# EAGLE design 32_ch_sample_and_hold (EAGLE 7.2.0)
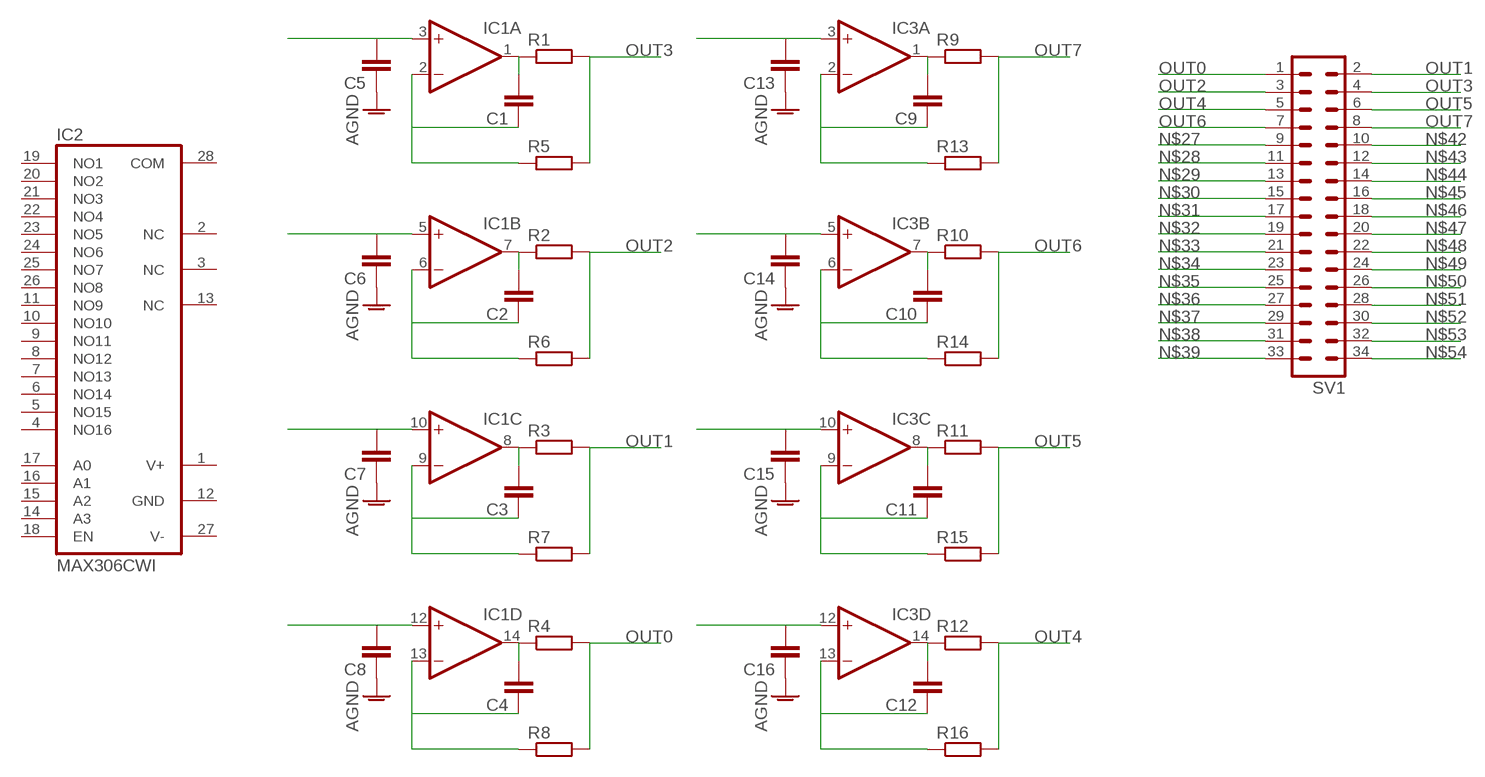
[diagram p0: schematic, sheet 1]

## Parts
C1  C-EUC0603  [C0603]
C2  C-EUC0603  [C0603]
C3  C-EUC0603  [C0603]
C4  C-EUC0603  [C0603]
C5  C-EUC1206  [C1206]
C6  C-EUC1206  [C1206]
C7  C-EUC1206  [C1206]
C8  C-EUC1206  [C1206]
C9  C-EUC0603  [C0603]
C10  C-EUC0603  [C0603]
C11  C-EUC0603  [C0603]
C12  C-EUC0603  [C0603]
C13  C-EUC1206  [C1206]
C14  C-EUC1206  [C1206]
C15  C-EUC1206  [C1206]
C16  C-EUC1206  [C1206]
IC1  TL074D  [SO14]
IC2  MAX306CWI  [SO28L]
IC3  TL074D  [SO14]
R1  R-EU_R0603  [R0603]
R2  R-EU_R0603  [R0603]
R3  R-EU_R0603  [R0603]
R4  R-EU_R0603  [R0603]
R5  R-EU_R0603  [R0603]
R6  R-EU_R0603  [R0603]
R7  R-EU_R0603  [R0603]
R8  R-EU_R0603  [R0603]
R9  R-EU_R0603  [R0603]
R10  R-EU_R0603  [R0603]
R11  R-EU_R0603  [R0603]
R12  R-EU_R0603  [R0603]
R13  R-EU_R0603  [R0603]
R14  R-EU_R0603  [R0603]
R15  R-EU_R0603  [R0603]
R16  R-EU_R0603  [R0603]
SV1  MA17-2  [MA17-2]

## Nets
AGND: C5.1 C6.1 C7.1 C8.1 C13.1 C14.1 C15.1 C16.1
N$1: C1.2 IC1.1(A:OUT) R1.1
N$2: C2.2 IC1.7(B:OUT) R2.1
N$3: C3.2 IC1.8(C:OUT) R3.1
N$4: C4.2 IC1.14(D:OUT) R4.1
N$5: C1.1 IC1.2(A:-IN) R5.1
N$6: C2.1 IC1.6(B:-IN) R6.1
N$7: C3.1 IC1.9(C:-IN) R7.1
N$8: C4.1 IC1.13(D:-IN) R8.1
N$9: C9.2 IC3.1(A:OUT) R9.1
N$10: C10.2 IC3.7(B:OUT) R10.1
N$11: C11.2 IC3.8(C:OUT) R11.1
N$12: C12.2 IC3.14(D:OUT) R12.1
N$13: C8.2 IC1.12(D:+IN)
N$14: C7.2 IC1.10(C:+IN)
N$15: C6.2 IC1.5(B:+IN)
N$16: C5.2 IC1.3(A:+IN)
N$17: C9.1 IC3.2(A:-IN) R13.1
N$18: C10.1 IC3.6(B:-IN) R14.1
N$19: C11.1 IC3.9(C:-IN) R15.1
N$20: C12.1 IC3.13(D:-IN) R16.1
N$21: C16.2 IC3.12(D:+IN)
N$22: C15.2 IC3.10(C:+IN)
N$23: C14.2 IC3.5(B:+IN)
N$24: C13.2 IC3.3(A:+IN)
N$27: SV1.9
N$28: SV1.11
N$29: SV1.13
N$30: SV1.15
N$31: SV1.17
N$32: SV1.19
N$33: SV1.21
N$34: SV1.23
N$35: SV1.25
N$36: SV1.27
N$37: SV1.29
N$38: SV1.31
N$39: SV1.33
N$42: SV1.10
N$43: SV1.12
N$44: SV1.14
N$45: SV1.16
N$46: SV1.18
N$47: SV1.20
N$48: SV1.22
N$49: SV1.24
N$50: SV1.26
N$51: SV1.28
N$52: SV1.30
N$53: SV1.32
N$54: SV1.34
OUT0: R4.2 R8.2 SV1.1
OUT1: R3.2 R7.2 SV1.2
OUT2: R2.2 R6.2 SV1.3
OUT3: R1.2 R5.2 SV1.4
OUT4: R12.2 R16.2 SV1.5
OUT5: R11.2 R15.2 SV1.6
OUT6: R10.2 R14.2 SV1.7
OUT7: R9.2 R13.2 SV1.8
Unconnected: IC2.2(NC) IC2.3(NC) IC2.4(NO16) IC2.5(NO15) IC2.6(NO14) IC2.7(NO13) IC2.8(NO12) IC2.9(NO11) IC2.10(NO10) IC2.11(NO9) IC2.13(NC) IC2.14(A3) IC2.15(A2) IC2.16(A1) IC2.17(A0) IC2.18(EN) IC2.19(NO1) IC2.20(NO2) IC2.21(NO3) IC2.22(NO4) IC2.23(NO5) IC2.24(NO6) IC2.25(NO7) IC2.26(NO8) IC2.28(COM)

## Power pins joined to a net without a drawn wire
GND: IC2.12(GND)
V+: IC1.4(P:V+) IC2.1(V+) IC3.4(P:V+)
V-: IC1.11(P:V-) IC2.27(V-) IC3.11(P:V-)

## Library data of the parts
C1-C16 = resistor:C-EU: CAPACITOR, European symbol
IC1 IC3 = linear:TL074: OP AMP
IC2 = maxim:MAX306CWI: MULTIPLEXER; MF: MAXIM; MPN: MAX306CWI; OC_FARNELL: unknown; OC_NEWARK: 90C2555
R1-R16 = resistor:R-EU_: RESISTOR, European symbol
SV1 = con-lstb:MA17-2: PIN HEADER; OC_FARNELL: unknown; OC_NEWARK: unknown

## Board
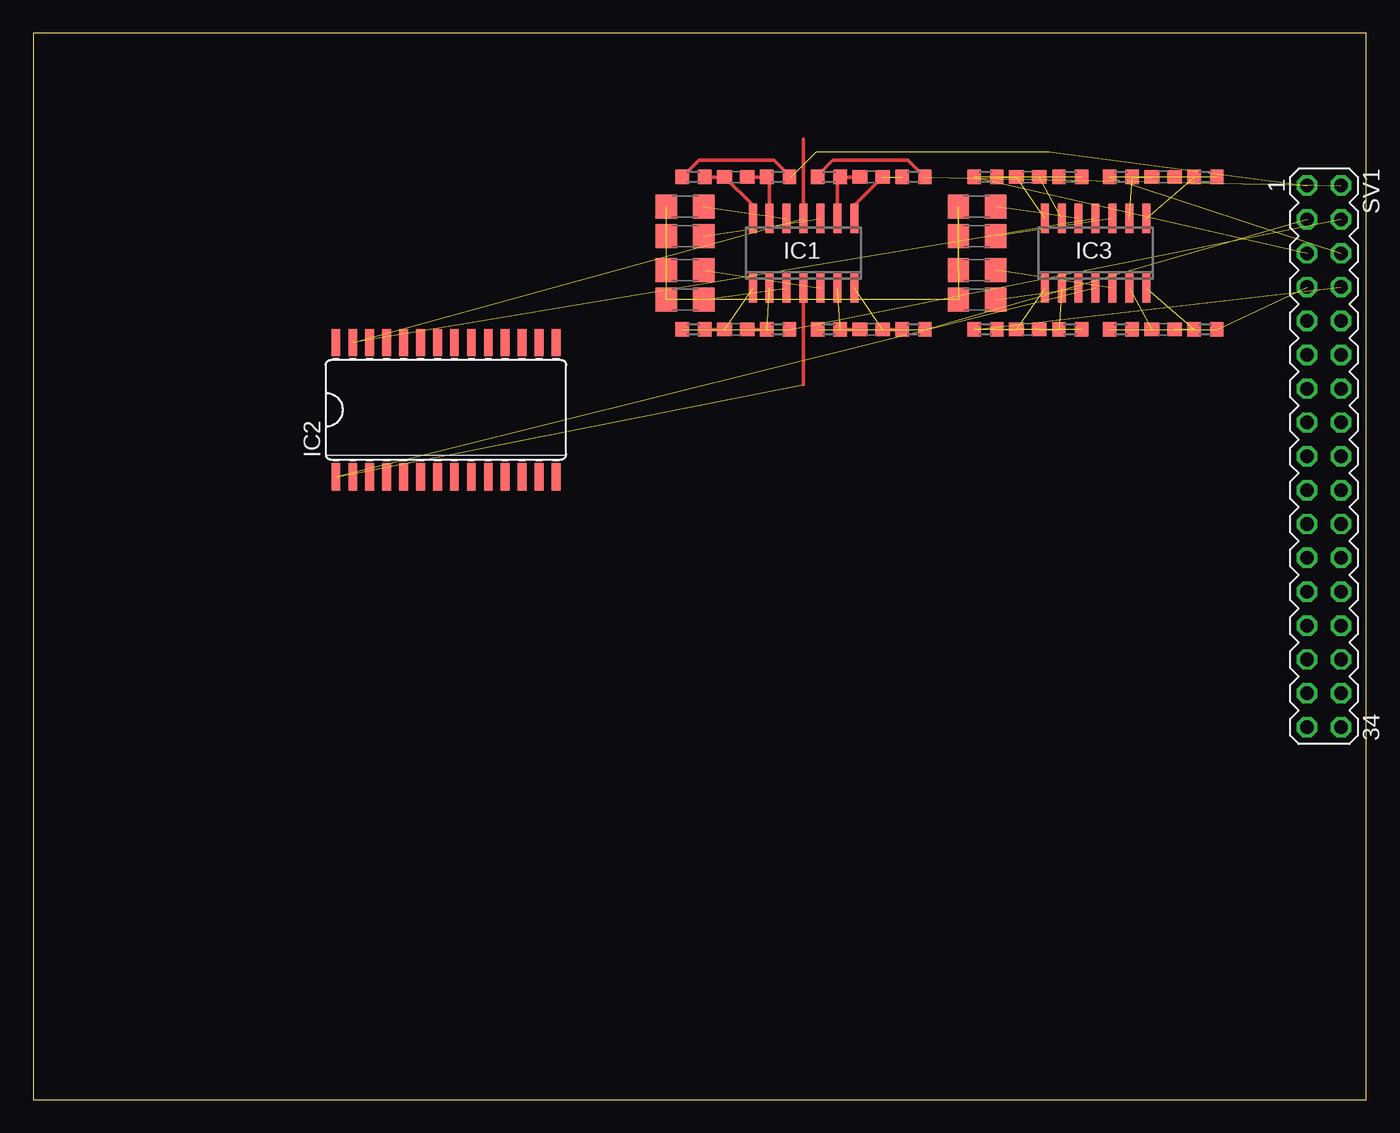
[diagram p1: board, top side]

Size 100 x 80 mm. Coordinates in mm from the lower left corner, seen from the top.
Outline: 0,0 100,0 100,80 0,80 0,0
Copper layers (1*16): Top 0.0356mm / dielectric 1.5011mm / Bottom 0.0356mm
Design rules "LaenPCBOrder": minimum track width 6mil, minimum drill 13mil, track to track 6mil, track to pad 6mil, pad to pad 6mil, via to via 6mil, smd to smd 6mil, copper to edge 15mil, drill to drill 6mil, minimum pad ring 7mil, minimum via ring 7mil, stop-mask expansion 3mil, vias tented up to drill 0mil, thermal gap 10mil

### Footprints (pad centres in the part's own frame; a part is rotated, then mirrored left to right if it is on the bottom)
C0603 = smd 1.1 x 1: 1 -0.85,0; 2 0.85,0
C1206 = smd 1.6 x 1.8: 1 -1.4,0; 2 1.4,0
SO14 = smd 0.6 x 2.2: 1 -3.81,-2.6; 2 -2.54,-2.6; 3 -1.27,-2.6; 4 0,-2.6; 5 1.27,-2.6; 6 2.54,-2.6; 7 3.81,-2.6; 8 3.81,2.6; 9 2.54,2.6; 10 1.27,2.6; 11 0,2.6; 12 -1.27,2.6; 13 -2.54,2.6; 14 -3.81,2.6
SO28L = smd 0.66 x 2.032: 1 -8.255,-5.029; 2 -6.985,-5.029; 3 -5.715,-5.029; 4 -4.445,-5.029; 5 -3.175,-5.029; 6 -1.905,-5.029; 7 -0.635,-5.029; 8 0.635,-5.029; 9 1.905,-5.029; 10 3.175,-5.029; 11 4.445,-5.029; 12 5.715,-5.029; 13 6.985,-5.029; 14 8.255,-5.029; 15 8.255,5.029; 16 6.985,5.029; 17 5.715,5.029; 18 4.445,5.029; 19 3.175,5.029; 20 1.905,5.029; 21 0.635,5.029; 22 -0.635,5.029; 23 -1.905,5.029; 24 -3.175,5.029; 25 -4.445,5.029; 26 -5.715,5.029; 27 -6.985,5.029; 28 -8.255,5.029
R0603 = smd 1 x 1.1: 1 -0.85,0; 2 0.85,0
MA17-2 = drill 1.016 octagon: 1 -20.32,-1.27; 2 -20.32,1.27; 3 -17.78,-1.27; 4 -17.78,1.27; 5 -15.24,-1.27; 6 -15.24,1.27; 7 -12.7,-1.27; 8 -12.7,1.27; 9 -10.16,-1.27; 10 -10.16,1.27; 11 -7.62,-1.27; 12 -7.62,1.27; 13 -5.08,-1.27; 14 -5.08,1.27; 15 -2.54,-1.27; 16 -2.54,1.27; 17 0,-1.27; 18 0,1.27; 19 2.54,-1.27; 20 2.54,1.27; 21 5.08,-1.27; 22 5.08,1.27; 23 7.62,-1.27; 24 7.62,1.27; 25 10.16,-1.27; 26 10.16,1.27; 27 12.7,-1.27; 28 12.7,1.27; 29 15.24,-1.27; 30 15.24,1.27; 31 17.78,-1.27; 32 17.78,1.27; 33 20.32,-1.27; 34 20.32,1.27

### Placement (x,y rotation side)
C1  52.7,57.78 180 top
C2  62.87,57.78 0 top
C3  62.87,69.22 0 top
C4  52.7,69.22 180 top
C5  48.9,60.01 0 top
C6  48.9,62.23 0 top
C7  48.9,64.77 0 top
C8  48.9,66.99 0 top
C9  74.61,57.78 180 top
C10  84.77,57.78 0 top
C11  84.77,69.22 0 top
C12  74.61,69.22 180 top
C13  70.8,60.01 0 top
C14  70.8,62.23 0 top
C15  70.8,64.77 0 top
C16  70.8,66.99 0 top
IC1  57.78,63.5 0 top
IC2  30.96,51.75 0 top
IC3  79.69,63.5 0 top
R1  49.53,57.78 180 top
R2  66.04,57.78 0 top
R3  66.04,69.22 0 top
R4  49.53,69.22 180 top
R5  55.88,57.78 0 top
R6  59.69,57.78 180 top
R7  59.69,69.22 180 top
R8  55.88,69.22 0 top
R9  71.44,57.78 180 top
R10  87.95,57.78 0 top
R11  87.95,69.22 0 top
R12  71.44,69.22 180 top
R13  77.79,57.78 0 top
R14  81.6,57.78 180 top
R15  81.6,69.22 180 top
R16  77.79,69.22 180 top
SV1  96.84,48.26 270 top

### Tracks (layer width: path | path; a pad name or v marks a point on that pad's centre or on a via)
AGND  (7 unrouted)
N$1  (1 unrouted)
  Top 0.254: R1.1 C1.2
N$2  (1 unrouted)
  Top 0.254: C2.2 R2.1
N$3  (1 unrouted)
  Top 0.254: IC1.8 61.59,67.09 C3.2
N$4
  Top 0.254: R4.1 C4.2 53.98,67.09 IC1.14
N$5  (1 unrouted)
  Top 0.254: C1.1 R5.1
N$6  (1 unrouted)
  Top 0.254: R6.1 C2.1
N$7
  Top 0.254: IC1.9 60.33,69.22 R7.1 C3.1
N$8
  Top 0.254: C4.1 R8.1 55.24,69.22 IC1.13
N$9  (2 unrouted)
N$10  (2 unrouted)
N$11  (2 unrouted)
N$12  (2 unrouted)
N$13  (1 unrouted)
N$14  (1 unrouted)
N$15  (1 unrouted)
N$16  (1 unrouted)
N$17  (2 unrouted)
N$18  (2 unrouted)
N$19  (2 unrouted)
N$20  (2 unrouted)
N$21  (1 unrouted)
N$22  (1 unrouted)
N$23  (1 unrouted)
N$24  (1 unrouted)
OUT0  (3 unrouted)
  Top 0.254: R4.2 49.95,70.48 55.56,70.48 56.73,69.32 R8.2 56.83,69.22
OUT1  (1 unrouted)
  Top 0.254: R7.2 58.84,69.32 60.01,70.48 65.62,70.48 R3.2
OUT2  (2 unrouted)
OUT3  (2 unrouted)
OUT4  (2 unrouted)
OUT5  (2 unrouted)
OUT6  (2 unrouted)
OUT7  (2 unrouted)
V+  (2 unrouted)
  Top 0.254: IC1.4 57.78,53.66
V-  (2 unrouted)
  Top 0.254: IC1.11 57.78,72.07